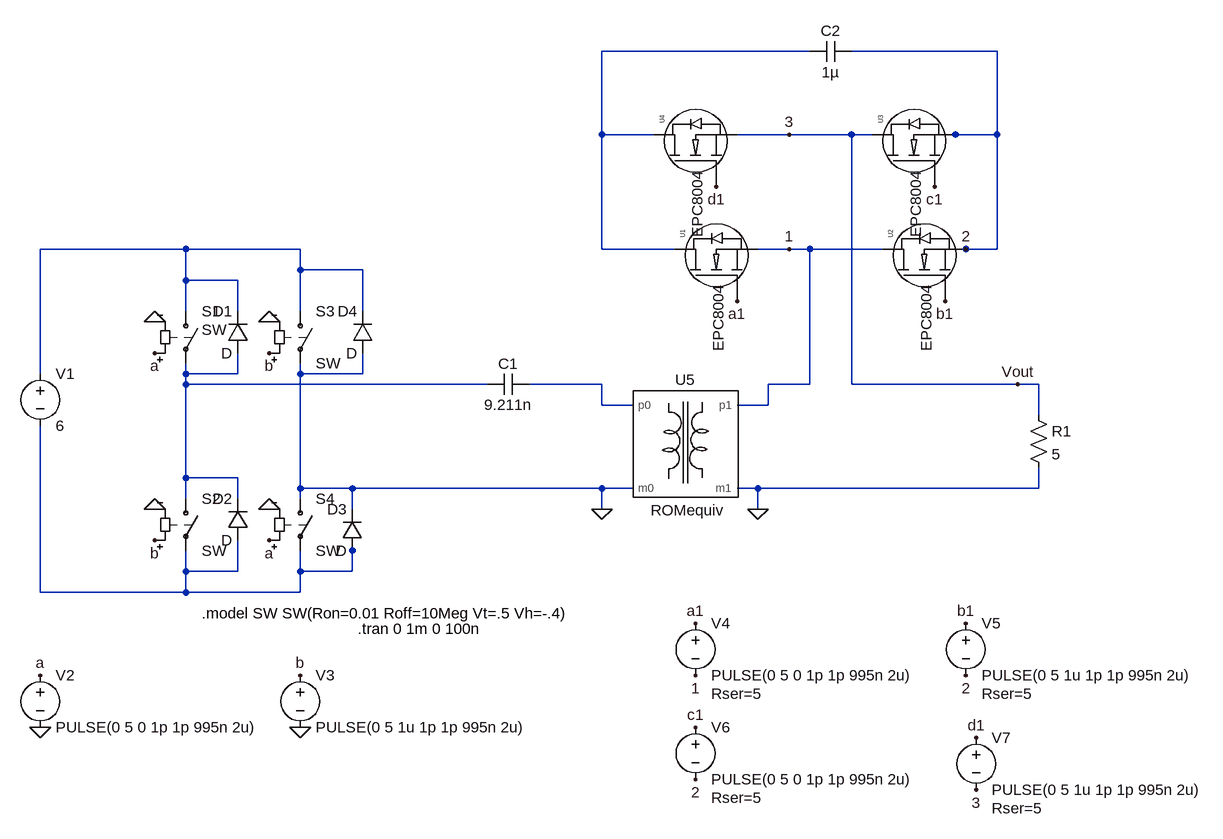
[diagram p0: schematic WPT_GaN_auto.asc]
WPT_GaN_auto.asc, the LTspice schematic file:
Version 4
SHEET 1 1328 796
WIRE 704 -400 384 -400
WIRE 992 -400 768 -400
WIRE 384 -272 384 -400
WIRE 464 -272 384 -272
WIRE 672 -272 592 -272
WIRE 768 -272 672 -272
WIRE 800 -272 768 -272
WIRE 928 -272 912 -272
WIRE 992 -272 992 -400
WIRE 992 -272 928 -272
WIRE -256 -96 -480 -96
WIRE -80 -96 -256 -96
WIRE 384 -96 384 -272
WIRE 496 -96 384 -96
WIRE 672 -96 624 -96
WIRE 704 -96 672 -96
WIRE 816 -96 704 -96
WIRE 944 -96 912 -96
WIRE 992 -96 992 -272
WIRE 992 -96 944 -96
WIRE -80 -64 -80 -96
WIRE 16 -64 -80 -64
WIRE -256 -48 -256 -96
WIRE -176 -48 -256 -48
WIRE -256 0 -256 -48
WIRE -176 0 -176 -48
WIRE -80 0 -80 -64
WIRE 16 0 16 -64
WIRE -480 96 -480 -96
WIRE -256 96 -256 80
WIRE -176 96 -176 64
WIRE -176 96 -256 96
WIRE -80 96 -80 80
WIRE 16 96 16 64
WIRE 16 96 -80 96
WIRE -256 112 -256 96
WIRE 208 112 -256 112
WIRE 384 112 272 112
WIRE 704 112 704 -96
WIRE 704 112 640 112
WIRE 768 112 768 -272
WIRE 1024 112 768 112
WIRE 1056 112 1024 112
WIRE 384 144 384 112
WIRE 432 144 384 144
WIRE 640 144 640 112
WIRE 640 144 592 144
WIRE 1056 160 1056 112
WIRE -256 256 -256 112
WIRE -176 256 -256 256
WIRE -80 272 -80 96
WIRE 0 272 -80 272
WIRE 384 272 0 272
WIRE 432 272 384 272
WIRE 624 272 592 272
WIRE 1056 272 1056 240
WIRE 1056 272 624 272
WIRE -256 288 -256 256
WIRE -176 288 -176 256
WIRE -80 288 -80 272
WIRE 0 304 0 272
WIRE 384 304 384 272
WIRE 624 304 624 272
WIRE 0 368 0 352
WIRE -256 400 -256 368
WIRE -176 400 -176 352
WIRE -176 400 -256 400
WIRE -80 400 -80 368
WIRE 0 400 0 368
WIRE 0 400 -80 400
WIRE -480 432 -480 176
WIRE -256 432 -256 400
WIRE -256 432 -480 432
WIRE -80 432 -80 400
WIRE -80 432 -256 432
FLAG -480 560 a
FLAG -80 560 b
FLAG -304 64 a
FLAG -128 352 a
FLAG -304 352 b
FLAG -128 64 b
FLAG -304 16 0
FLAG -128 16 0
FLAG -128 304 0
FLAG -304 304 0
FLAG 592 -16 a1
FLAG 896 -192 c1
FLAG 912 -16 b1
FLAG 560 -192 d1
FLAG 384 304 0
FLAG 624 304 0
FLAG -480 640 0
FLAG -80 640 0
FLAG 528 480 a1
FLAG 944 480 b1
FLAG 672 -96 1
FLAG 944 -96 2
FLAG 672 -272 3
FLAG 528 560 1
FLAG 944 560 2
FLAG 528 640 c1
FLAG 960 656 d1
FLAG 528 720 2
FLAG 960 736 3
FLAG 1024 112 Vout
SYMBOL voltage -480 80 R0
WINDOW 123 0 0 Left 0
WINDOW 39 0 0 Left 0
SYMATTR InstName V1
SYMATTR Value 6
SYMBOL voltage -480 544 R0
WINDOW 123 0 0 Left 0
WINDOW 39 0 0 Left 0
SYMATTR InstName V2
SYMATTR Value PULSE(0 5 0 1p 1p 995n 2u)
SYMBOL voltage -80 544 R0
WINDOW 123 0 0 Left 0
WINDOW 39 0 0 Left 0
SYMATTR InstName V3
SYMATTR Value PULSE(0 5 1u 1p 1p 995n 2u)
SYMBOL sw -256 -16 R0
WINDOW 3 24 44 Left 2
SYMATTR InstName S1
SYMBOL sw -256 272 R0
SYMATTR InstName S2
SYMBOL sw -80 -16 R0
SYMATTR InstName S3
SYMBOL sw -80 272 R0
SYMATTR InstName S4
SYMBOL cap 272 96 R90
WINDOW 0 0 32 VBottom 2
WINDOW 3 32 32 VTop 2
SYMATTR InstName C1
SYMATTR Value 9.211n
SYMBOL cap 768 -416 R90
WINDOW 0 0 32 VBottom 2
WINDOW 3 32 32 VTop 2
SYMATTR InstName C2
SYMATTR Value 1µ
SYMBOL res 1040 144 R0
SYMATTR InstName R1
SYMATTR Value 5
SYMBOL diode -160 64 R180
WINDOW 0 24 64 Left 2
WINDOW 3 24 0 Left 2
SYMATTR InstName D1
SYMBOL diode -160 352 R180
WINDOW 0 24 64 Left 2
WINDOW 3 24 0 Left 2
SYMATTR InstName D2
SYMBOL diode 16 368 R180
WINDOW 0 24 64 Left 2
WINDOW 3 24 0 Left 2
SYMATTR InstName D3
SYMBOL diode 32 64 R180
WINDOW 0 24 64 Left 2
WINDOW 3 24 0 Left 2
SYMATTR InstName D4
SYMBOL voltage 528 464 R0
WINDOW 123 0 0 Left 0
WINDOW 39 24 124 Left 2
SYMATTR SpiceLine Rser=5
SYMATTR InstName V4
SYMATTR Value PULSE(0 5 0 1p 1p 995n 2u)
SYMBOL voltage 944 464 R0
WINDOW 123 0 0 Left 0
WINDOW 39 24 124 Left 2
SYMATTR SpiceLine Rser=5
SYMATTR InstName V5
SYMATTR Value PULSE(0 5 1u 1p 1p 995n 2u)
SYMBOL voltage 528 624 R0
WINDOW 123 0 0 Left 0
WINDOW 39 24 124 Left 2
SYMATTR SpiceLine Rser=5
SYMATTR InstName V6
SYMATTR Value PULSE(0 5 0 1p 1p 995n 2u)
SYMBOL voltage 960 640 R0
WINDOW 123 0 0 Left 0
WINDOW 39 24 124 Left 2
SYMATTR SpiceLine Rser=5
SYMATTR InstName V7
SYMATTR Value PULSE(0 5 1u 1p 1p 995n 2u)
SYMBOL EPCGaN 592 -16 R270
WINDOW 3 -78 -29 Left 2
SYMATTR Value EPC8004
SYMATTR InstName U1
SYMBOL EPCGaN 912 -16 R270
WINDOW 3 -78 -29 Left 2
SYMATTR Value EPC8004
SYMATTR InstName U2
SYMBOL EPCGaN 896 -192 R270
WINDOW 3 -78 -29 Left 2
SYMATTR Value EPC8004
SYMATTR InstName U3
SYMBOL EPCGaN 560 -192 R270
WINDOW 3 -78 -29 Left 2
SYMATTR Value EPC8004
SYMATTR InstName U4
SYMBOL ROMequiv 512 192 R0
SYMATTR InstName U5
TEXT 8 488 Left 2 !.tran 0 1m 0 100n
TEXT -232 464 Left 2 !.model SW SW(Ron=0.01 Roff=10Meg Vt=.5 Vh=-.4)

The netlist it stands for:
* WPT_GaN_auto.asc
V1 N002 N005 6
V2 a 0 PULSE(0 5 0 1p 1p 995n 2u)
V3 b 0 PULSE(0 5 1u 1p 1p 995n 2u)
S1 N002 N003 a 0 SW
S2 N003 N005 b 0 SW
S3 N002 0 b 0 SW
S4 0 N005 a 0 SW
C1 N004 N003 9.211n
C2 2 N001 1µ
R1 Vout 0 5
D1 N003 N002 D
D2 N005 N003 D
D3 N005 0 D
D4 0 N002 D
V4 a1 1 PULSE(0 5 0 1p 1p 995n 2u) Rser=5
V5 b1 2 PULSE(0 5 1u 1p 1p 995n 2u) Rser=5
V6 c1 2 PULSE(0 5 0 1p 1p 995n 2u) Rser=5
V7 d1 Vout PULSE(0 5 1u 1p 1p 995n 2u) Rser=5
XU1 a1 N001 1 EPC8004  ; pins gatein drainin N_0
XU2 b1 1 2 EPC8004  ; pins gatein drainin N_0
XU3 c1 Vout 2 EPC8004  ; pins gatein drainin N_0
XU4 d1 N001 Vout EPC8004  ; pins gatein drainin N_0
XU5 N004 0 1 0 ROMequiv  ; pins p0 m0 p1 m1
.model D D
.lib standard.dio
.tran 0 1m 0 100n
.model SW SW(Ron=0.01 Roff=10Meg Vt=.5 Vh=-.4)
.lib EPCGanlibrary.lib
.lib equiv_circuitROM.spice
.backanno
.end